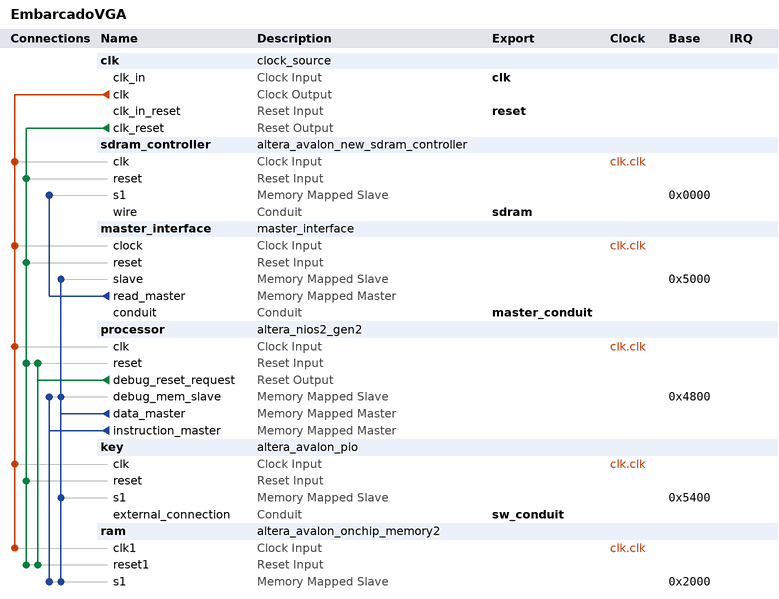
[diagram p0: system contents]
# Platform Designer (Qsys) system EmbarcadoVGA, Cyclone IV E EP4CE115F29C7
# Parameters at their usual value, and those the tool derives, are not listed.
package require -exact qsys 18.1
create_system EmbarcadoVGA
set_project_property DEVICE_FAMILY {Cyclone IV E}
set_project_property DEVICE EP4CE115F29C7

add_instance clk clock_source 18.1
set_instance_parameter_value clk clockFrequency 100000000

add_instance sdram_controller altera_avalon_new_sdram_controller 18.1
set_instance_parameter_value sdram_controller TAC 5.5
set_instance_parameter_value sdram_controller TRCD 20.0
set_instance_parameter_value sdram_controller TRP 20.0
set_instance_parameter_value sdram_controller casLatency 3
set_instance_parameter_value sdram_controller columnWidth 10
set_instance_parameter_value sdram_controller dataWidth 32
set_instance_parameter_value sdram_controller generateSimulationModel true
set_instance_parameter_value sdram_controller model single_Micron_MT48LC4M32B2_7_chip
set_instance_parameter_value sdram_controller numberOfBanks 4
set_instance_parameter_value sdram_controller numberOfChipSelects 1
set_instance_parameter_value sdram_controller powerUpDelay 200.0
set_instance_parameter_value sdram_controller refreshPeriod 7.8125
set_instance_parameter_value sdram_controller rowWidth 13

add_instance master_interface master_interface 3.2

add_instance processor altera_nios2_gen2 18.1
set_instance_parameter_value processor dcache_size 2048
set_instance_parameter_value processor exceptionSlave ram.s1
set_instance_parameter_value processor icache_size 2048
set_instance_parameter_value processor impl Tiny
set_instance_parameter_value processor resetSlave ram.s1

add_instance key altera_avalon_pio 18.1
set_instance_parameter_value key direction Input
set_instance_parameter_value key width 4

add_instance ram altera_avalon_onchip_memory2 18.1
set_instance_parameter_value ram dataWidth 32
set_instance_parameter_value ram dualPort false
set_instance_parameter_value ram initMemContent true
set_instance_parameter_value ram initializationFileName onchip_mem.hex
set_instance_parameter_value ram memorySize 8192

# connections
add_connection clk.clk key.clk clock
add_connection clk.clk master_interface.clock clock
add_connection clk.clk processor.clk clock
add_connection clk.clk ram.clk1 clock
add_connection clk.clk sdram_controller.clk clock
add_connection clk.clk_reset key.reset reset
add_connection clk.clk_reset master_interface.reset reset
add_connection clk.clk_reset processor.reset reset
add_connection clk.clk_reset ram.reset1 reset
add_connection clk.clk_reset sdram_controller.reset reset
add_connection processor.debug_reset_request processor.reset reset
add_connection processor.debug_reset_request ram.reset1 reset
add_connection master_interface.read_master sdram_controller.s1 avalon
set_connection_parameter_value master_interface.read_master/sdram_controller.s1 baseAddress 0x0000
add_connection processor.data_master key.s1 avalon
set_connection_parameter_value processor.data_master/key.s1 baseAddress 0x5400
add_connection processor.data_master master_interface.slave avalon
set_connection_parameter_value processor.data_master/master_interface.slave baseAddress 0x5000
add_connection processor.data_master processor.debug_mem_slave avalon
set_connection_parameter_value processor.data_master/processor.debug_mem_slave baseAddress 0x4800
add_connection processor.data_master ram.s1 avalon
set_connection_parameter_value processor.data_master/ram.s1 baseAddress 0x2000
add_connection processor.instruction_master processor.debug_mem_slave avalon
set_connection_parameter_value processor.instruction_master/processor.debug_mem_slave baseAddress 0x4800
add_connection processor.instruction_master ram.s1 avalon
set_connection_parameter_value processor.instruction_master/ram.s1 baseAddress 0x2000

# exported interfaces
add_interface clk clock sink
set_interface_property clk EXPORT_OF clk.clk_in
add_interface master_conduit conduit end
set_interface_property master_conduit EXPORT_OF master_interface.conduit
add_interface reset reset sink
set_interface_property reset EXPORT_OF clk.clk_in_reset
add_interface sdram conduit end
set_interface_property sdram EXPORT_OF sdram_controller.wire
add_interface sw_conduit conduit end
set_interface_property sw_conduit EXPORT_OF key.external_connection

set_interconnect_requirement {$system} qsys_mm.clockCrossingAdapter HANDSHAKE
set_interconnect_requirement {$system} qsys_mm.enableEccProtection FALSE
set_interconnect_requirement {$system} qsys_mm.insertDefaultSlave FALSE
set_interconnect_requirement {$system} qsys_mm.maxAdditionalLatency 1

save_system EmbarcadoVGA.qsys
